# EAGLE schematic Fish Detector (EAGLE 6.2)
Bullduino Fish Detector
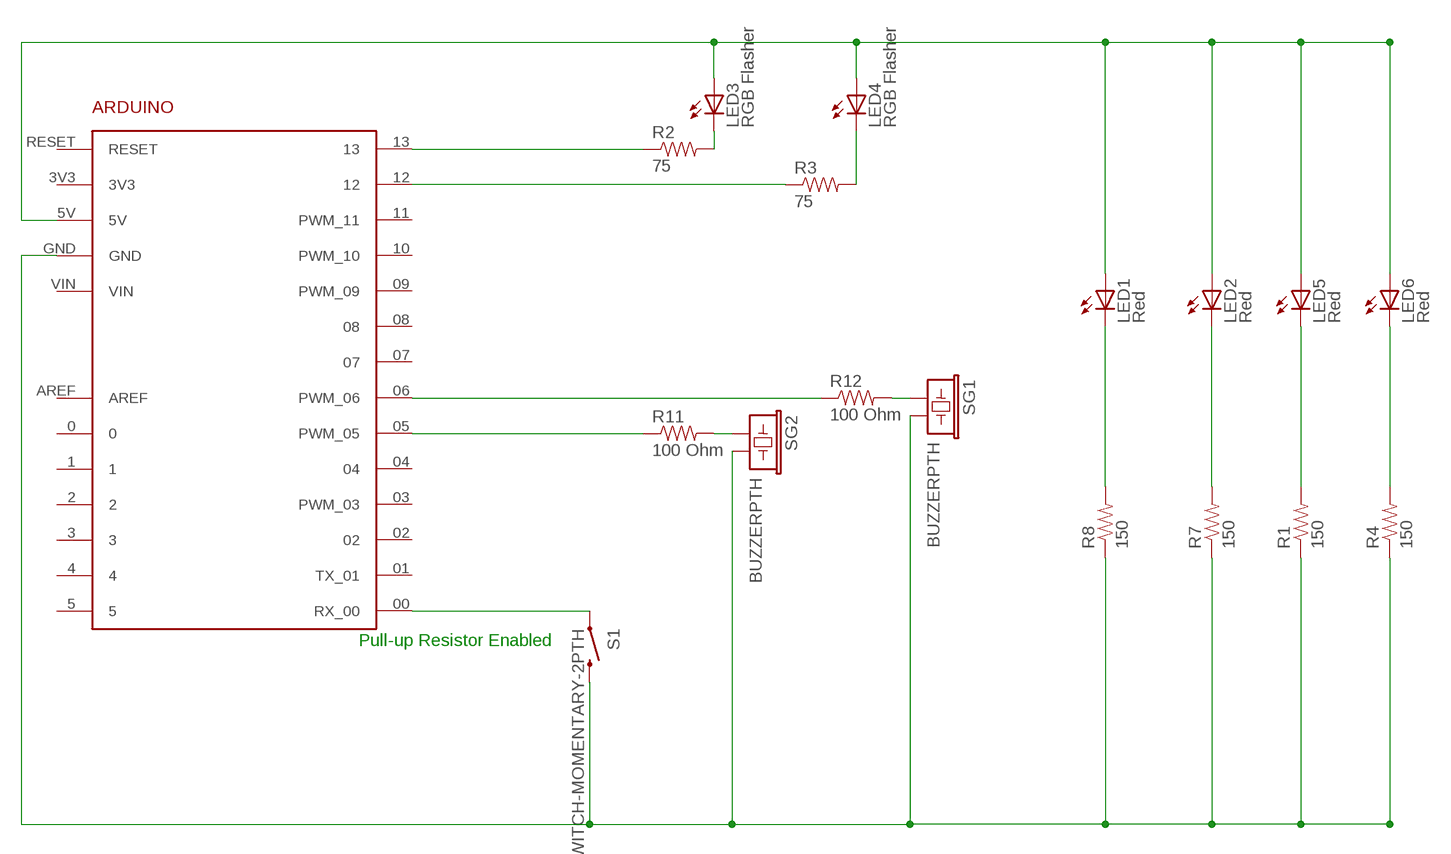
[diagram p0: schematic, sheet 1]

## Parts
ARDUINO1  ARDUINO  [ARDUINO]
LED1  Red  LED5MM  [LED5MM]
LED2  Red  LED5MM  [LED5MM]
LED3  RGB Flasher  LED5MM  [LED5MM]
LED4  RGB Flasher  LED5MM  [LED5MM]
LED5  Red  LED5MM  [LED5MM]
LED6  Red  LED5MM  [LED5MM]
R1  150  RESISTORAXIAL-0.3  [AXIAL-0.3]
R2  75  RESISTORAXIAL-0.3  [AXIAL-0.3]
R3  75  RESISTORAXIAL-0.3  [AXIAL-0.3]
R4  150  RESISTORAXIAL-0.3  [AXIAL-0.3]
R7  150  RESISTORAXIAL-0.3  [AXIAL-0.3]
R8  150  RESISTORAXIAL-0.3  [AXIAL-0.3]
R11  100 Ohm  RESISTORAXIAL-0.3  [AXIAL-0.3]
R12  100 Ohm  RESISTORAXIAL-0.3  [AXIAL-0.3]
S1  SWITCH-MOMENTARY-2PTH  [TACTILE-PTH]
SG1  BUZZERPTH  [BUZZER-12MM]
SG2  BUZZERPTH  [BUZZER-12MM]

## Nets
N$1: ARDUINO1.13 R2.P$1
N$2: ARDUINO1.GND R1.P$1 R4.P$1 R7.P$1 R8.P$1 S1.3 SG1.- SG2.-
N$3: ARDUINO1.06(PWM_06) R12.P$1
N$4: ARDUINO1.00(RX_00) S1.1
N$5: ARDUINO1.05(PWM_05) R11.P$1
N$6: LED1.K(C) R8.P$2
N$7: R12.P$2 SG1.+
N$8: LED2.K(C) R7.P$2
N$9: LED3.K(C) R2.P$2
N$10: ARDUINO1.12 R3.P$1
N$11: LED4.K(C) R3.P$2
N$12: R11.P$2 SG2.+
N$14: LED5.K(C) R1.P$2
N$16: ARDUINO1.5V LED1.A LED2.A LED3.A LED4.A LED5.A LED6.A
N$17: LED6.K(C) R4.P$2
Unconnected: ARDUINO1.0 ARDUINO1.1 ARDUINO1.01(TX_01) ARDUINO1.2 ARDUINO1.02 ARDUINO1.3 ARDUINO1.03(PWM_03) ARDUINO1.3V3 ARDUINO1.4 ARDUINO1.04 ARDUINO1.5 ARDUINO1.07 ARDUINO1.08 ARDUINO1.09(PWM_09) ARDUINO1.10(PWM_10) ARDUINO1.11(PWM_11) ARDUINO1.AREF ARDUINO1.RESET ARDUINO1.VIN

## Notes on the sheet
- Pull-up Resistor Enabled

## Library data of the parts
ARDUINO1 = arduino:ARDUINO: For creating Arduino shields
LED1-LED6 = SparkFun:LED: LEDs Standard schematic elements and footprints for 5mm, 3mm, 1206, and 0603 sized LEDs. 5mm - Spark Fun Electronics SKU : COM-00529 (and others)
R1-R4 R7 R8 R11 R12 = SparkFun:RESISTOR: Resistor Basic schematic elements and footprints for 0603, 1206, and PTH resistors.
S1 = SparkFun:SWITCH-MOMENTARY-2
SG1 SG2 = SparkFun:BUZZER: Buzzer 12mm Spark Fun Electronics SKU : Comp-Buzzer